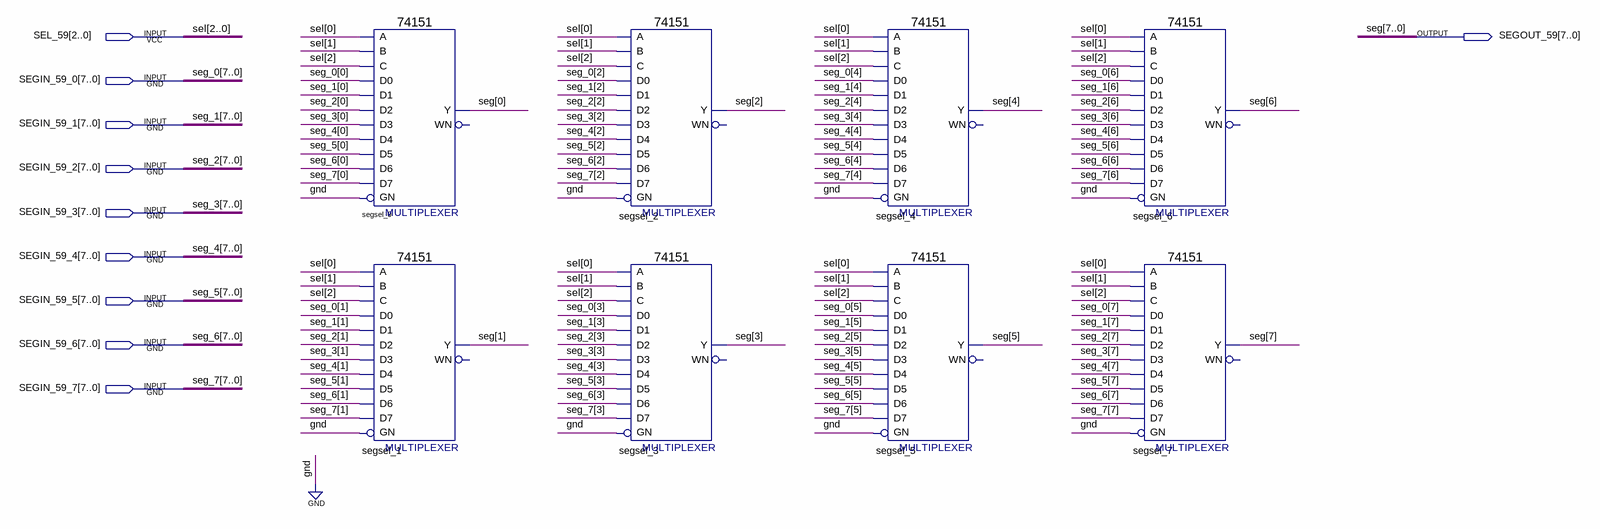
[diagram p0: schematic sheet]
// Quartus schematic segsel_59.bdf as structural Verilog: 8 symbols, 10 pins
module segsel_59 (
  input  [2:0] SEL_59,
  input  [7:0] SEGIN_59_0,
  input  [7:0] SEGIN_59_1,
  input  [7:0] SEGIN_59_2,
  input  [7:0] SEGIN_59_3,
  input  [7:0] SEGIN_59_4,
  input  [7:0] SEGIN_59_5,
  input  [7:0] SEGIN_59_6,
  input  [7:0] SEGIN_59_7,
  output [7:0] SEGOUT_59
);

  \74151  segsel_0 (
    .GN(1'b0), .C(SEL_59[2]), .B(SEL_59[1]), .A(SEL_59[0]), .D5(SEGIN_59_5[0]), .D0(SEGIN_59_0[0]),
    .D1(SEGIN_59_1[0]), .D4(SEGIN_59_4[0]), .D3(SEGIN_59_3[0]), .D2(SEGIN_59_2[0]), .D6(SEGIN_59_6[0]),
    .D7(SEGIN_59_7[0]), .Y(SEGOUT_59[0]));  // open: WN
  \74151  segsel_1 (
    .GN(1'b0), .C(SEL_59[2]), .B(SEL_59[1]), .A(SEL_59[0]), .D5(SEGIN_59_5[1]), .D0(SEGIN_59_0[1]),
    .D1(SEGIN_59_1[1]), .D4(SEGIN_59_4[1]), .D3(SEGIN_59_3[1]), .D2(SEGIN_59_2[1]), .D6(SEGIN_59_6[1]),
    .D7(SEGIN_59_7[1]), .Y(SEGOUT_59[1]));  // open: WN
  \74151  segsel_2 (
    .GN(1'b0), .C(SEL_59[2]), .B(SEL_59[1]), .A(SEL_59[0]), .D5(SEGIN_59_5[2]), .D0(SEGIN_59_0[2]),
    .D1(SEGIN_59_1[2]), .D4(SEGIN_59_4[2]), .D3(SEGIN_59_3[2]), .D2(SEGIN_59_2[2]), .D6(SEGIN_59_6[2]),
    .D7(SEGIN_59_7[2]), .Y(SEGOUT_59[2]));  // open: WN
  \74151  segsel_3 (
    .GN(1'b0), .C(SEL_59[2]), .B(SEL_59[1]), .A(SEL_59[0]), .D5(SEGIN_59_5[3]), .D0(SEGIN_59_0[3]),
    .D1(SEGIN_59_1[3]), .D4(SEGIN_59_4[3]), .D3(SEGIN_59_3[3]), .D2(SEGIN_59_2[3]), .D6(SEGIN_59_6[3]),
    .D7(SEGIN_59_7[3]), .Y(SEGOUT_59[3]));  // open: WN
  \74151  segsel_4 (
    .GN(1'b0), .C(SEL_59[2]), .B(SEL_59[1]), .A(SEL_59[0]), .D5(SEGIN_59_5[4]), .D0(SEGIN_59_0[4]),
    .D1(SEGIN_59_1[4]), .D4(SEGIN_59_4[4]), .D3(SEGIN_59_3[4]), .D2(SEGIN_59_2[4]), .D6(SEGIN_59_6[4]),
    .D7(SEGIN_59_7[4]), .Y(SEGOUT_59[4]));  // open: WN
  \74151  segsel_5 (
    .GN(1'b0), .C(SEL_59[2]), .B(SEL_59[1]), .A(SEL_59[0]), .D5(SEGIN_59_5[5]), .D0(SEGIN_59_0[5]),
    .D1(SEGIN_59_1[5]), .D4(SEGIN_59_4[5]), .D3(SEGIN_59_3[5]), .D2(SEGIN_59_2[5]), .D6(SEGIN_59_6[5]),
    .D7(SEGIN_59_7[5]), .Y(SEGOUT_59[5]));  // open: WN
  \74151  segsel_6 (
    .GN(1'b0), .C(SEL_59[2]), .B(SEL_59[1]), .A(SEL_59[0]), .D5(SEGIN_59_5[6]), .D0(SEGIN_59_0[6]),
    .D1(SEGIN_59_1[6]), .D4(SEGIN_59_4[6]), .D3(SEGIN_59_3[6]), .D2(SEGIN_59_2[6]), .D6(SEGIN_59_6[6]),
    .D7(SEGIN_59_7[6]), .Y(SEGOUT_59[6]));  // open: WN
  \74151  segsel_7 (
    .GN(1'b0), .C(SEL_59[2]), .B(SEL_59[1]), .A(SEL_59[0]), .D5(SEGIN_59_5[7]), .D0(SEGIN_59_0[7]),
    .D1(SEGIN_59_1[7]), .D4(SEGIN_59_4[7]), .D3(SEGIN_59_3[7]), .D2(SEGIN_59_2[7]), .D6(SEGIN_59_6[7]),
    .D7(SEGIN_59_7[7]), .Y(SEGOUT_59[7]));  // open: WN

  // Other names for the same wires on the sheet: seg[7:0] = SEGOUT_59; seg_0[7:0] = SEGIN_59_0;
  //   seg_1[7:0] = SEGIN_59_1; seg_2[7:0] = SEGIN_59_2; seg_3[7:0] = SEGIN_59_3; seg_4[7:0] = SEGIN_59_4;
  //   seg_5[7:0] = SEGIN_59_5; seg_6[7:0] = SEGIN_59_6; seg_7[7:0] = SEGIN_59_7; sel[2:0] = SEL_59
endmodule
